# EAGLE design NRF Breakout (EAGLE 6.4)
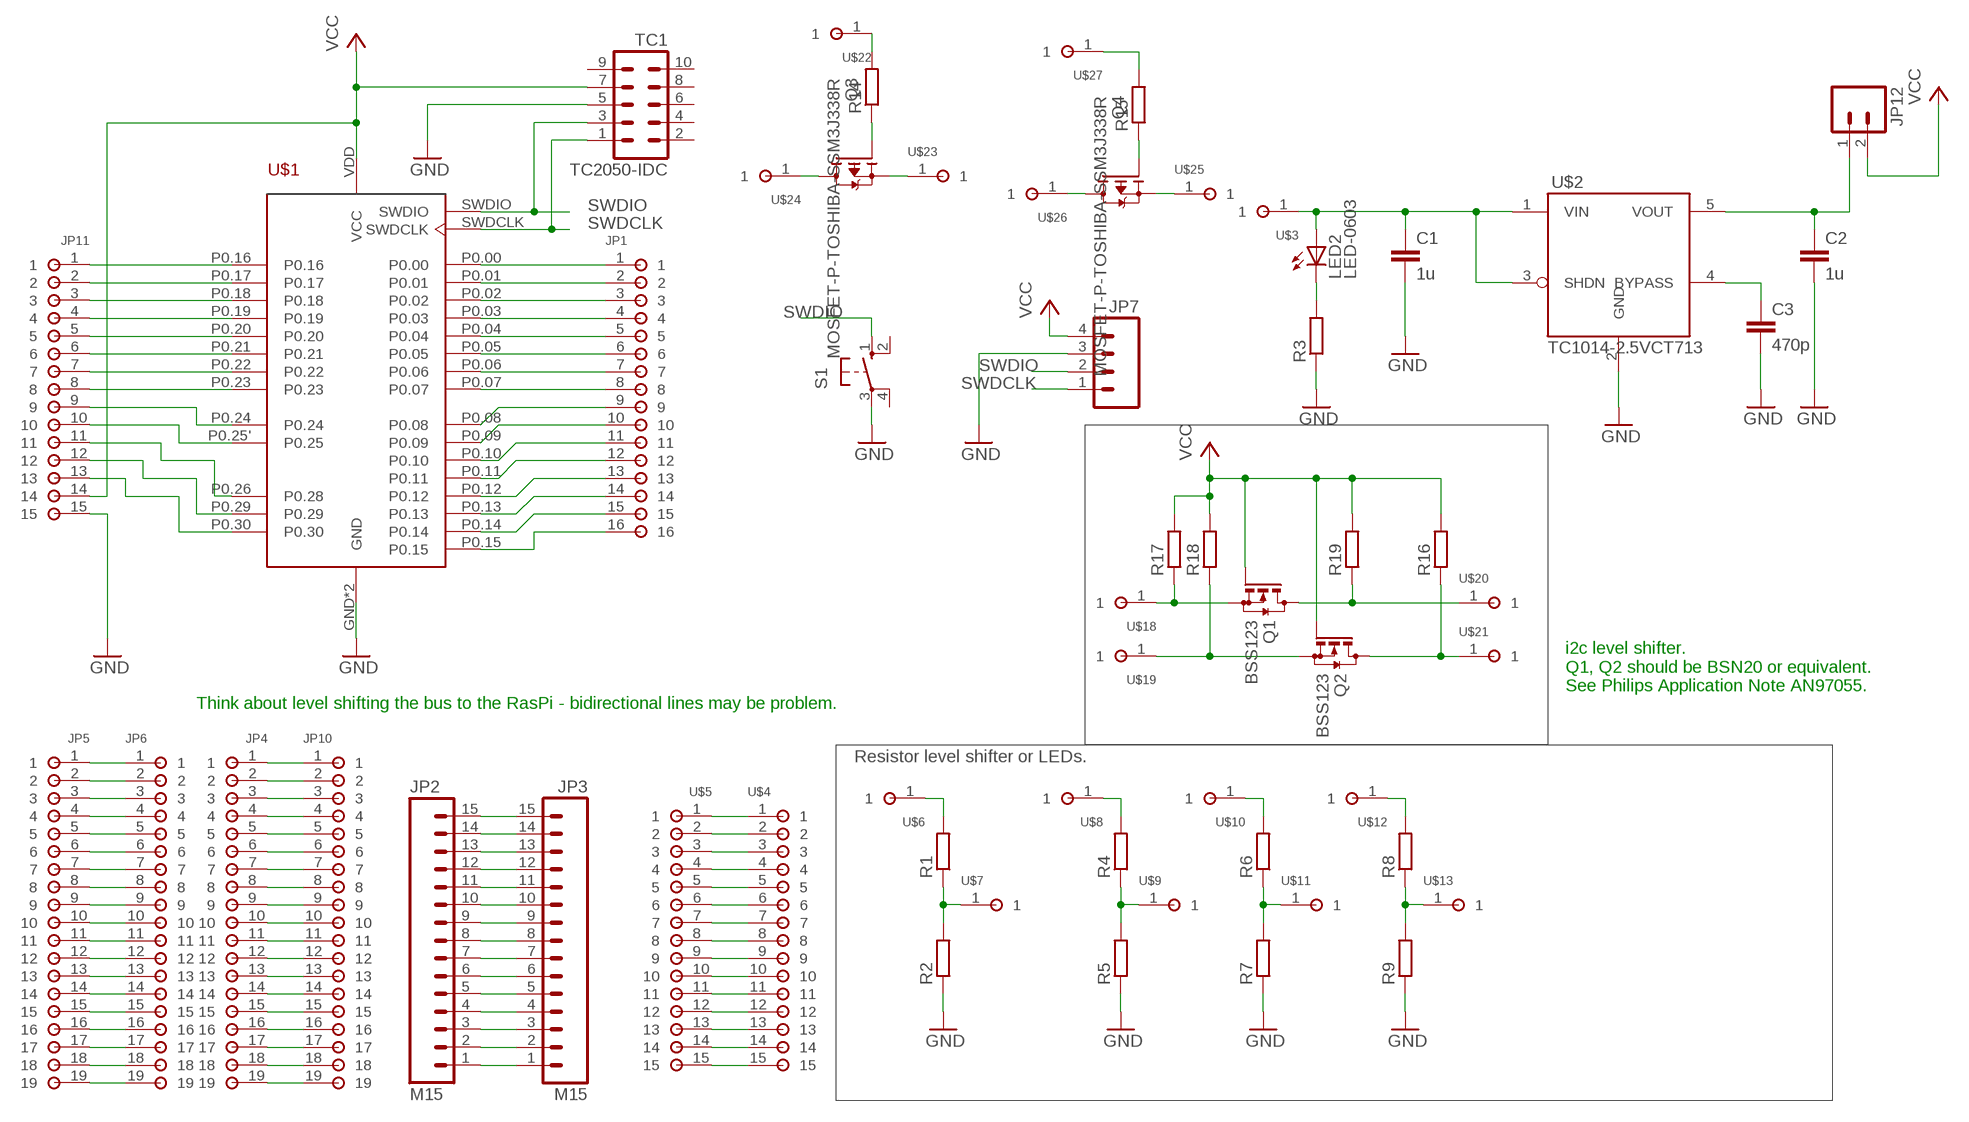
[diagram p0: schematic, sheet 1]

## Parts
C1  1u  C-EUC0603  [C0603]
C2  1u  C-EUC0603  [C0603]
C3  470p  C-EUC0603  [C0603]
JP1  PAD-16-TH  [PAD-16-TH]
JP2  M15  [1X15]
JP3  M15  [1X15]
JP4  PAD-19-2.54-TH  [PAD-19-2.54-TH]
JP5  PAD-19-2.54-TH  [PAD-19-2.54-TH]
JP6  PAD-19-2.54-TH  [PAD-19-2.54-TH]
JP7  M04PTH  [1X04]
JP10  PAD-19-2.54-TH  [PAD-19-2.54-TH]
JP11  PAD-15  [PAD-15-TH]
JP12  M02PTH  [1X02]
LED2  LED-0603  [CHIPLED_0603]
Q1  BSS123  [SOT23]
Q2  BSS123  [SOT23]
Q3  MOSFET-P-TOSHIBA-SSM3J338R  [SOT23]
Q4  MOSFET-P-TOSHIBA-SSM3J338R  [SOT23]
R1  R-EU_R0603  [R0603]
R2  R-EU_R0603  [R0603]
R3  R-EU_R0603  [R0603]
R4  R-EU_R0603  [R0603]
R5  R-EU_R0603  [R0603]
R6  R-EU_R0603  [R0603]
R7  R-EU_R0603  [R0603]
R8  R-EU_R0603  [R0603]
R9  R-EU_R0603  [R0603]
R14  R-EU_R0603  [R0603]
R15  R-EU_R0603  [R0603]
R16  R-EU_R0603  [R0603]
R17  R-EU_R0603  [R0603]
R18  R-EU_R0603  [R0603]
R19  R-EU_R0603  [R0603]
S1  TACT-4PIN  [B3F-10XX]
TC1  TC2050-IDC  [TC2050-IDC]
U$1  BREAKOUT-NRF51822CORE-SULLINS-NPPN092FFKS-RC  [BREAKOUT-NRF51822-CORE-SULLINS-NPPN092FFKS-RC]
U$2  TC1014-2.5VCT713  [SOT-23-5]
U$3  PAD-1-TH  [PAD-1-TH]
U$4  PAD-15  [PAD-15-TH]
U$5  PAD-15  [PAD-15-TH]
U$6  PAD-1-TH  [PAD-1-TH]
U$7  PAD-1-TH  [PAD-1-TH]
U$8  PAD-1-TH  [PAD-1-TH]
U$9  PAD-1-TH  [PAD-1-TH]
U$10  PAD-1-TH  [PAD-1-TH]
U$11  PAD-1-TH  [PAD-1-TH]
U$12  PAD-1-TH  [PAD-1-TH]
U$13  PAD-1-TH  [PAD-1-TH]
U$18  PAD-1-TH  [PAD-1-TH]
U$19  PAD-1-TH  [PAD-1-TH]
U$20  PAD-1-TH  [PAD-1-TH]
U$21  PAD-1-TH  [PAD-1-TH]
U$22  PAD-1-TH  [PAD-1-TH]
U$23  PAD-1-TH  [PAD-1-TH]
U$24  PAD-1-TH  [PAD-1-TH]
U$25  PAD-1-TH  [PAD-1-TH]
U$26  PAD-1-TH  [PAD-1-TH]
U$27  PAD-1-TH  [PAD-1-TH]

## Nets
GND: C1.2 C2.2 C3.2 JP7.3 JP11.15 R2.1 R3.1 R5.1 R7.1 R9.1 S1.3(P) TC1.5 U$1.GND U$1.GND2(GND) U$2.2(GND)
HIGH1: Q1.3(D) R19.1 U$20.1
HIGH2: Q2.3(D) R16.1 U$21.1
LOW1: Q1.2(S) R17.1 U$18.1
LOW2: Q2.2(S) R18.1 U$19.1
N$1: JP2.1 JP3.1
N$2: C3.1 U$2.4(BYPASS)
N$4: R1.2 U$6.1
N$5: R1.1 R2.2 U$7.1
N$7: JP5.2 JP6.2
N$8: JP5.14 JP6.14
N$9: JP5.3 JP6.3
N$10: JP5.4 JP6.4
N$11: JP5.5 JP6.5
N$12: JP5.6 JP6.6
N$13: JP5.7 JP6.7
N$14: JP5.8 JP6.8
N$15: JP5.9 JP6.9
N$16: JP5.10 JP6.10
N$17: JP5.11 JP6.11
N$18: JP5.12 JP6.12
N$19: JP5.13 JP6.13
N$20: JP5.15 JP6.15
N$21: JP5.16 JP6.16
N$22: R14.2 U$22.1
N$23: JP11.2 U$1.P0.17
N$24: JP11.3 U$1.P0.18
N$25: JP11.4 U$1.P0.19
N$26: JP11.5 U$1.P0.20
N$27: JP1.12 U$1.P0.11
N$28: JP1.11 U$1.P0.10
N$29: JP1.13 U$1.P0.12
N$30: R4.2 U$8.1
N$31: JP1.6 U$1.P0.05
N$32: JP1.14 U$1.P0.13
N$33: JP1.15 U$1.P0.14
N$34: Q3.1(G) R14.1
N$35: JP11.6 U$1.P0.21
N$36: JP11.7 U$1.P0.22
N$37: JP11.8 U$1.P0.23
N$38: JP5.17 JP6.17
N$39: JP5.18 JP6.18
N$40: JP5.19 JP6.19
N$41: JP5.1 JP6.1
N$42: JP4.19 JP10.19
N$43: JP4.18 JP10.18
N$44: JP4.17 JP10.17
N$45: JP4.16 JP10.16
N$46: JP4.15 JP10.15
N$47: JP4.14 JP10.14
N$48: JP4.13 JP10.13
N$49: JP4.12 JP10.12
N$50: JP4.11 JP10.11
N$51: JP4.10 JP10.10
N$52: JP4.9 JP10.9
N$53: JP4.8 JP10.8
N$54: JP4.7 JP10.7
N$55: JP4.6 JP10.6
N$56: JP4.5 JP10.5
N$57: JP4.4 JP10.4
N$58: JP4.3 JP10.3
N$59: JP4.2 JP10.2
N$60: JP4.1 JP10.1
N$61: JP2.2 JP3.2
N$62: JP2.3 JP3.3
N$63: JP2.4 JP3.4
N$64: JP2.5 JP3.5
N$65: JP2.6 JP3.6
N$66: JP2.7 JP3.7
N$67: JP2.8 JP3.8
N$68: JP2.9 JP3.9
N$69: JP2.10 JP3.10
N$70: JP2.11 JP3.11
N$71: JP2.12 JP3.12
N$72: JP2.13 JP3.13
N$73: JP2.14 JP3.14
N$74: JP2.15 JP3.15
N$75: U$4.1 U$5.1
N$76: U$4.2 U$5.2
N$77: U$4.3 U$5.3
N$78: U$4.4 U$5.4
N$79: U$4.5 U$5.5
N$80: U$4.6 U$5.6
N$81: U$4.7 U$5.7
N$82: U$4.8 U$5.8
N$83: U$4.9 U$5.9
N$84: U$4.10 U$5.10
N$85: U$4.11 U$5.11
N$86: U$4.12 U$5.12
N$87: U$4.13 U$5.13
N$88: U$4.14 U$5.14
N$89: U$4.15 U$5.15
N$90: R4.1 R5.2 U$9.1
N$91: LED2.C R3.2
N$92: R6.2 U$10.1
N$93: R6.1 R7.2 U$11.1
N$94: R8.2 U$12.1
N$95: R8.1 R9.2 U$13.1
N$100: Q3.3(D) U$24.1
N$101: Q3.2(S) U$23.1
N$102: R15.2 U$27.1
N$103: Q4.1(G) R15.1
N$104: Q4.2(S) U$25.1
N$105: Q4.3(D) U$26.1
P0.00: JP1.1 U$1.P0.00
P0.01: JP1.2 U$1.P0.01
P0.02: JP1.3 U$1.P0.02
P0.03: JP1.4 U$1.P0.03
P0.04: JP1.5 U$1.P0.04
P0.06: JP1.7 U$1.P0.06
P0.07: JP1.8 U$1.P0.07
P0.08: JP1.9 U$1.P0.08
P0.09: JP1.10 U$1.P0.09
P0.15: JP1.16 U$1.P0.15
P0.16: JP11.1 U$1.P0.16
P0.24: JP11.9 U$1.P0.24
P0.25: JP11.10 U$1.P0.25'(P0.25)
P0.28: JP11.11 U$1.P0.26(P0.28)
P0.29: JP11.12 U$1.P0.29
P0.30: JP11.13 U$1.P0.30
SWDCLK: JP7.1 TC1.1 U$1.SWDCLK
SWDIO: JP7.2 S1.1(S) TC1.3 U$1.SWDIO
VCC: JP7.4 JP11.14 JP12.2 Q1.1(G) Q2.1(G) R16.2 R17.2 R18.2 R19.2 TC1.7 U$1.VDD(VCC)
VIN: C1.1 LED2.A U$2.1(VIN) U$2.3(SHDN) U$3.1
VOUT: C2.1 JP12.1 U$2.5(VOUT)
Unconnected: S1.2(S1) S1.4(P1) TC1.2 TC1.4 TC1.6 TC1.8 TC1.9 TC1.10

## Notes on the sheet
- i2c level shifter. 
  Q1, Q2 should be BSN20 or equivalent. 
  See Philips Application Note AN97055.
- Think about level shifting the bus to the RasPi - bidirectional lines may be problem.
- Resistor level shifter or LEDs.

## Library data of the parts
C1-C3 = Erland's Library:C-EU: CAPACITOR, European symbol
JP1 = Erland's Library:PAD-16
JP2 JP3 = SparkFun-Connectors:M15: Header 15 Standard 15-pin 0.1" header. Use with straight break away headers (SKU : PRT-00116), right angle break away headers (PRT-00553), swiss pins (PRT-00743), machine pins (PRT-00117), and female headers (PRT-00115).
JP4-JP6 JP10 = Erland's Library:PAD-19
JP7 = SparkFun-Connectors:M04: Header 4 Standard 4-pin 0.1" header. Use with straight break away headers (SKU : PRT-00116), right angle break away headers (PRT-00553), swiss pins (PRT-00743), machine pins (PRT-00117), and female headers (PRT-00115). Molex polarized connector foot print use with SKU : PRT-08231 with associated crimp pins and housings. 1MM SMD Version SKU: PRT-10208
JP11 U$4 U$5 = Erland's Library:PAD-15
JP12 = SparkFun-Connectors:M02: Header 2 Standard 2-pin 0.1" header. Use with straight break away headers (SKU : PRT-00116), right angle break away headers (PRT-00553), swiss pins (PRT-00743), machine pins (PRT-00117), and female headers (PRT-00115). Molex polarized connector foot print use with SKU : PRT-08233 with associated crimp pins and housings.
LED2 = Erland's Library:LED
Q1 Q2 = Erland's Library:BSS123: N-CHANNEL MOS FET
Q3 Q4 = Erland's Library:MOSFET-P
R1-R9 R14-R19 = Erland's Library:R-EU_: RESISTOR, European symbol
S1 = Erland's Library:TACT-4PIN: OMRON SWITCH; MPN: B3F-1000; OC_FARNELL: 176432; OC_NEWARK: 36M3542
TC1 = TagConnect:TC2050-IDC: Tag-Connect In Circuit Programming & Debug Cable 10 Pin http://www.tag-connect.com
U$1 = Erland's Library:BREAKOUT-NRF51822CORE
U$2 = Erland's Library:TC1014
U$3 U$6-U$13 U$18-U$27 = Erland's Library:PAD-1

## Board
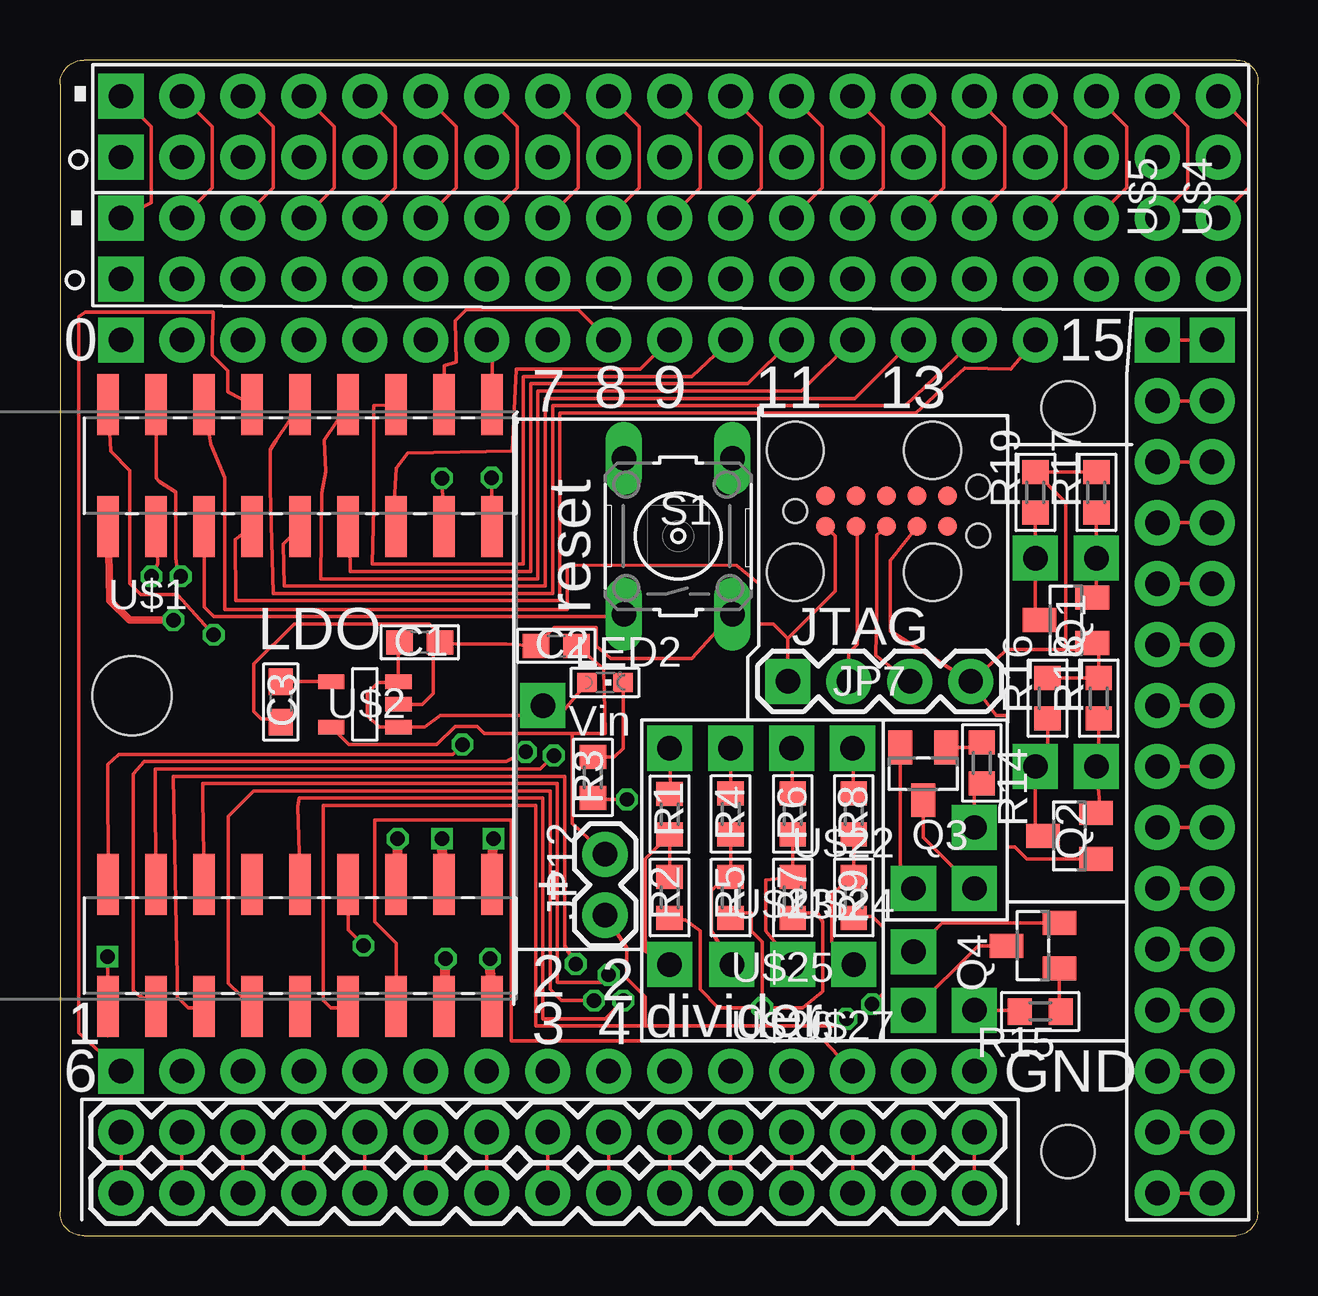
[diagram p1: board, top side]
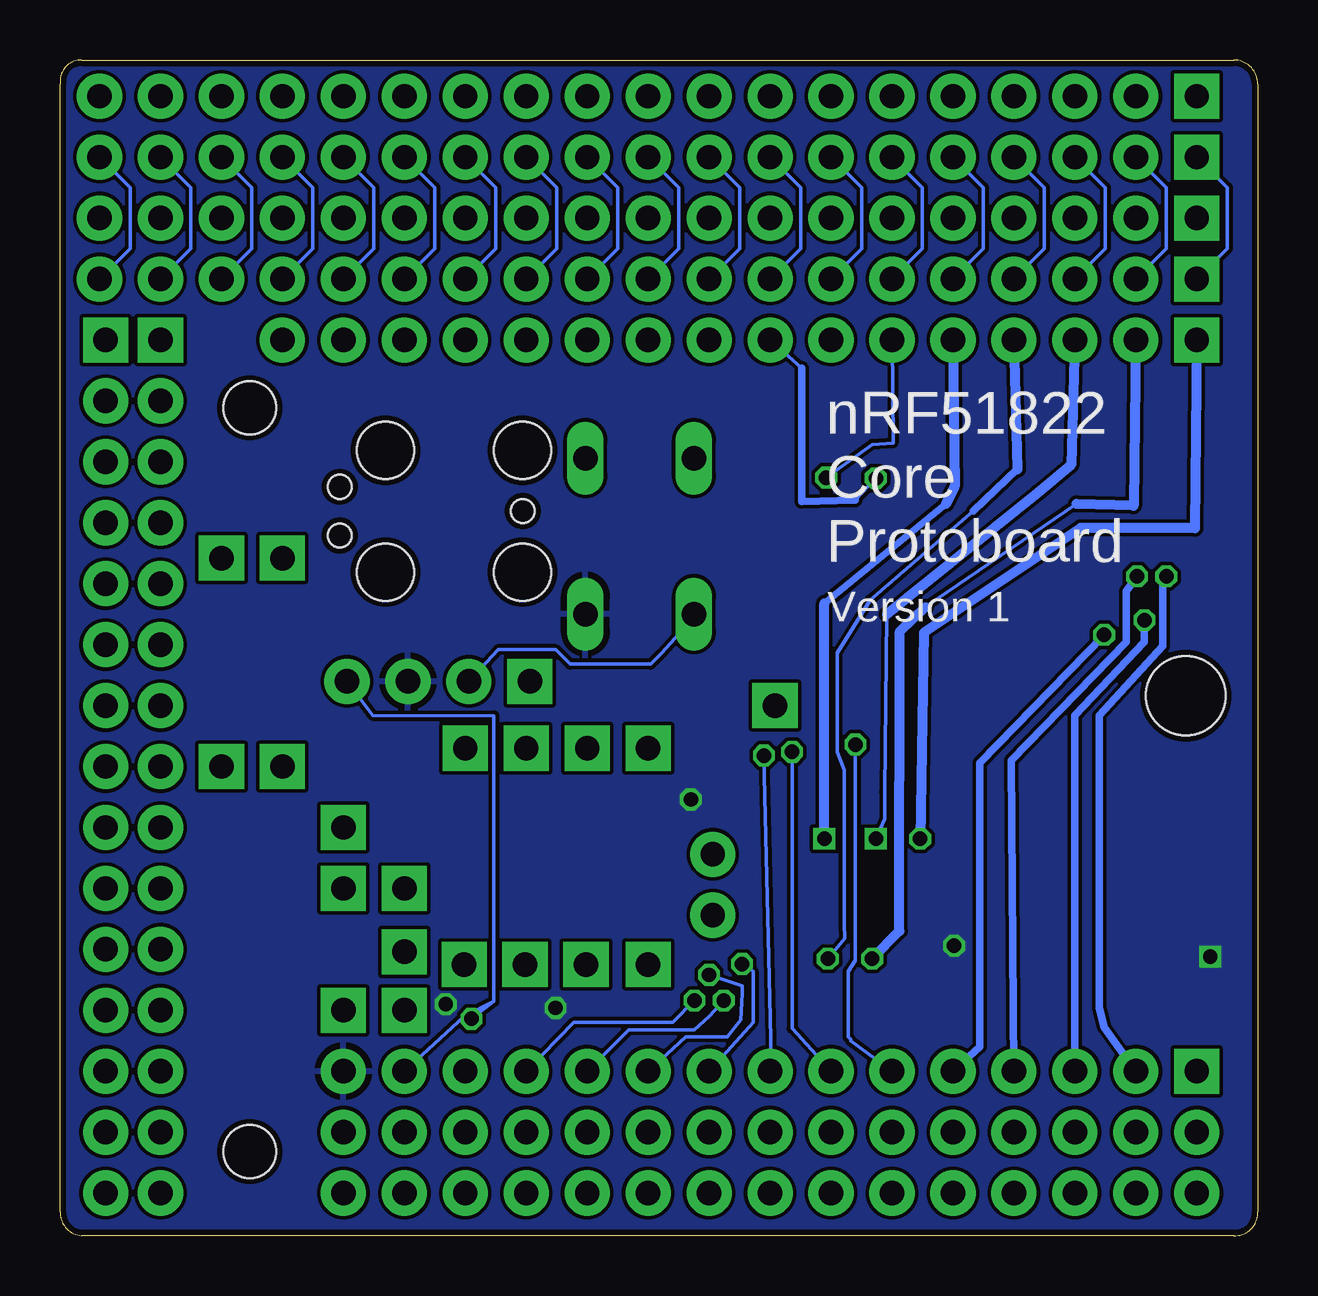
[diagram p2: board, bottom side, seen from below]

Size 49.91 x 49 mm. Coordinates in mm from the lower left corner, seen from the top.
Outline: 1,0 49,0 arc90 49.9,1 49.9,48 arc99 49,49 1,49 arc90 0,48 0,1 arc98 1,0
Copper layers (1*16): Top 0.035mm / dielectric 1.5mm / Bottom 0.035mm
Design rules "SeeedStudio_2layer_DRU_no_angle_20140221": minimum track width 6mil, minimum drill 12mil, track to track 6mil, track to pad 6mil, pad to pad 6mil, via to via 6mil, smd to smd 0mil, copper to edge 10mil, drill to drill 10mil, minimum pad ring 10mil, minimum via ring 6mil, stop-mask expansion 2mil, vias tented up to drill 100mil, thermal gap 10mil
Holes 3.3 mm at 3,22.5
Holes 2.2 mm at 42,34.5 42,3.5

### Footprints (pad centres in the part's own frame; a part is rotated, then mirrored left to right if it is on the bottom)
C0603 = smd 1.1 x 1: 1 -0.85,0; 2 0.85,0
PAD-16-TH = drill 1.016 pad 1.88 square: 1 0,0 | drill 1.016 pad 1.88: 2 2.54,0; 3 5.08,0; 4 7.62,0; 5 10.16,0; 6 12.7,0; 7 15.24,0; 8 17.78,0; 9 20.32,0; 10 22.86,0; 11 25.4,0; 12 27.94,0; 13 30.48,0; 14 33.02,0; 15 35.56,0; 16 38.1,0
1X15 = drill 1.016 pad 1.88: 1 0,0; 2 2.54,0; 3 5.08,0; 4 7.62,0; 5 10.16,0; 6 12.7,0; 7 15.24,0; 8 17.78,0; 9 20.32,0; 10 22.86,0; 11 25.4,0; 12 27.94,0; 13 30.48,0; 14 33.02,0; 15 35.56,0
PAD-19-2.54-TH = drill 1.016 pad 1.88 square: 1 0,0 | drill 1.016 pad 1.88: 2 2.54,0; 3 5.08,0; 4 7.62,0; 5 10.16,0; 6 12.7,0; 7 15.24,0; 8 17.78,0; 9 20.32,0; 10 22.86,0; 11 25.4,0; 12 27.94,0; 13 30.48,0; 14 33.02,0; 15 35.56,0; 16 38.1,0; 17 40.64,0; 18 43.18,0; 19 45.72,0
1X04 = drill 1.016 pad 1.88 square: 1 0,0 | drill 1.016 pad 1.88: 2 2.54,0; 3 5.08,0; 4 7.62,0
PAD-15-TH = drill 1.016 pad 1.88 square: 1 0,0 | drill 1.016 pad 1.88: 2 2.54,0; 3 5.08,0; 4 7.62,0; 5 10.16,0; 6 12.7,0; 7 15.24,0; 8 17.78,0; 9 20.32,0; 10 22.86,0; 11 25.4,0; 12 27.94,0; 13 30.48,0; 14 33.02,0; 15 35.56,0
1X02 = drill 1.016 pad 1.88: 1 0,0; 2 2.54,0
CHIPLED_0603 = smd 0.8 x 0.8: A 0,-0.75; C 0,0.75
SOT23 = smd 1 x 1.4: 1 -0.95,-1.1; 2 0.95,-1.1; 3 0,1.1
R0603 = smd 1 x 1.1: 1 -0.85,0; 2 0.85,0
B3F-10XX = drill 1.016 long: 1 -3.251,2.261; 2 3.251,2.261; 3 -3.251,-2.261; 4 3.251,-2.261
TC2050-IDC = smd 0.787 x 0.787: 1 -2.54,-0.635; 2 -2.54,0.635; 3 -1.27,-0.635; 4 -1.27,0.635; 5 0,-0.635; 6 0,0.635; 7 1.27,-0.635; 8 1.27,0.635; 9 2.54,-0.635; 10 2.54,0.635 | hole 0.991: -3.81,0; 3.81,1.016; 3.81,-1.016 | hole 2.375: -3.81,2.54; -3.81,-2.54; 1.905,2.54; 1.905,-2.54
BREAKOUT-NRF51822-CORE-SULLINS-NPPN092FFKS-RC = smd 0.89 x 2.54: GND 2,-7.46; GND2 -8,-12.54; P0.00 4,-7.46; P0.01 6,-12.54; P0.02 6,-7.46; P0.03 8,-12.54; P0.04 8,-7.46; P0.05 8,7.46; P0.06 8,12.54; P0.07 6,7.46; P0.08 6,12.54; P0.09 4,7.46; P0.10 4,12.54; P0.11 2,7.46; P0.12 2,12.54; P0.13 0,7.46; P0.14 0,12.54; P0.15 -2,7.46; P0.16 -2,12.54; P0.17 -6,7.46; P0.18 -8,7.46; P0.19 -6,12.54; P0.20 -8,12.54; P0.21 -8,-7.46; P0.22 -6,-12.54; P0.23 -6,-7.46; P0.24 -4,-12.54; P0.25' -4,-7.46; P0.26 -2,-12.54; P0.27 -2,-7.46; P0.28 0,-12.54; P0.29 0,-7.46; P0.30 4,-12.54; SWDCLK -4,12.54; SWDIO -4,7.46; VDD 2,-12.54
SOT-23-5 = smd 0.6 x 1.1: 1 -0.95,-1.4; 2 0,-1.4; 3 0.95,-1.4; 4 0.95,1.4; 5 -0.95,1.4
PAD-1-TH = drill 1.016 pad 1.88 square: 1 0,0

### Placement (x,y rotation side)
C1  14.99,24.73 0 top
C2  20.68,24.58 180 top
C3  9.2,22.24 270 top
JP1  2.54,37.33 0 top
JP2  2.54,4.31 0 top
JP3  2.54,1.77 0 top
JP4  2.54,44.95 0 top
JP5  2.54,42.41 0 top
JP6  2.54,47.49 0 top
JP7  30.33,23.1 0 top
JP10  2.54,39.87 0 top
JP11  2.54,6.85 0 top
JP12  22.71,15.89 270 top
LED2  22.71,23.06 270 top
Q1  41.91,25.65 90 top
Q2  42.06,16.66 90 top
Q3  35.97,19.25 180 top
Q4  40.54,12.08 90 top
R1  25.4,17.56 90 top
R2  25.4,14.09 90 top
R3  22.2,19.09 90 top
R4  27.94,17.57 90 top
R5  27.94,14.09 90 top
R6  30.53,17.57 90 top
R7  30.53,14.09 90 top
R8  33.07,17.57 90 top
R9  33.07,14.09 90 top
R14  38.41,19.7 270 top
R15  40.84,9.34 180 top
R16  41.15,22.4 90 top
R17  43.18,30.98 90 top
R18  43.28,22.4 90 top
R19  40.64,30.98 90 top
S1  25.76,29.15 90 top
TC1  34.44,30.19 0 top
U$1  10,22.09 0 top
U$2  12.7,22.14 90 top
U$3  20.12,22.09 0 top
U$4  48.01,37.33 270 top
U$5  45.72,37.33 270 top
U$6  25.4,20.31 0 top
U$7  25.4,11.3 0 top
U$8  27.94,20.31 0 top
U$9  27.99,11.3 0 top
U$10  30.48,20.31 0 top
U$11  30.53,11.3 0 top
U$12  33.02,20.31 0 top
U$13  33.07,11.3 0 top
U$18  43.18,28.24 90 top
U$19  43.18,19.55 90 top
U$20  40.64,28.24 90 top
U$21  40.64,19.55 90 top
U$22  38.1,17.01 0 top
U$23  35.56,14.47 0 top
U$24  38.1,14.47 0 top
U$25  35.56,11.83 0 top
U$26  35.56,9.39 0 top
U$27  38.1,9.39 0 top

### Tracks (layer width: path | path; a pad name or v marks a point on that pad's centre or on a via)
GND  (via drill 0.6)
  Top 0.152: U$1.GND2 1.98,8.32 v1.98,11.63 | U$2.2 15.09,22.14 15.55,22.6 15.55,24.44 C1.2 | C3.2 9.05,21.53 8.38,21.53 8.08,21.84 8.08,23.82 9.76,25.5 15.39,25.5 15.84,25.05 C1.2 | C1.2 16.51,24.67 18.59,24.67 C2.2 20.59,25.34 22.35,25.34 22.35,24.58 22.94,24.05 26.32,24.05 S1.3 | R2.1 25.66,13.15 26.06,13.15 26.67,12.69 26.67,10.26 27.43,9.49 v29.26,9.49 | R5.1 28.11,13.46 28.81,13.46 28.81,12.69 29.26,12.24 v29.26,9.49 | v29.26,9.49 30.94,9.49 31.78,10.18 | R7.1 30.85,13.46 31.55,13.46 31.78,13.07 31.78,10.18 | TC1.5 34.04,29.2 34.04,25.95 33.99,24.17 JP7.3 | R9.1 33.29,13.3 33.83,13.3 34.29,12.85 34.29,10.1 v33.83,9.65 | U$1.GND 12,12.73 v12.65,12.08 | 31.7,10.1 31.78,10.18 | v23.62,18.18 22.27,18.18 R3.1
  Bottom 0.152: S1.3 28.14,25.75
  pour Bottom: 0.31,48.81 50.08,49.11 49.94,-0.05 -0.1,0.01
HIGH1
  Top 0.152: R19.1 U$20.1 40.64,25.82 Q1.3
HIGH2
  Top 0.152: R16.1 41.15,19.65 U$21.1 40.64,16.98 Q2.3
LOW1
  Top 0.152: 43.13,28.34 U$18.1 | R17.1 U$18.1 | U$18.1 43.18,26.77 Q1.2
LOW2
  Top 0.152: R18.1 43.28,19.6 U$19.1 43.33,17.78 Q2.2
N$1
  Top 0.152: JP3.1 JP2.1
N$2
  Top 0.152: U$2.4 C3.1
N$4
  Top 0.152: R1.2 25.45,18.46 U$6.1
N$5
  Top 0.152: R2.2 R1.1 24.39,15.7 24.39,11.84 U$7.1
N$7
  Top 0.152: JP6.2 6.35,46.22 6.35,43.68 JP5.2
N$8
  Top 0.152: JP6.14 36.83,46.22 36.83,43.68 JP5.14
N$9
  Top 0.152: JP6.3 8.89,46.22 8.89,43.68 JP5.3
N$10
  Top 0.152: JP6.4 11.43,46.22 11.43,43.68 JP5.4
N$11
  Top 0.152: JP6.5 13.97,46.22 13.97,43.68 JP5.5
N$12
  Top 0.152: JP6.6 16.51,46.22 16.51,43.68 JP5.6
N$13
  Top 0.152: JP6.7 19.05,46.22 19.05,43.68 JP5.7
N$14
  Top 0.152: JP6.8 21.59,46.22 21.59,43.68 JP5.8
N$15
  Top 0.152: JP6.9 24.13,46.22 24.13,43.68 JP5.9
N$16
  Top 0.152: JP6.10 26.67,46.22 26.67,43.68 JP5.10
N$17
  Top 0.152: JP6.11 29.21,46.22 29.21,43.68 JP5.11
N$18
  Top 0.152: JP6.12 31.75,46.22 31.75,43.68 JP5.12
N$19
  Top 0.152: JP6.13 34.29,46.22 34.29,43.68 JP5.13
N$20
  Top 0.152: JP6.15 39.37,46.22 39.37,43.68 JP5.15
N$21
  Top 0.152: JP6.16 41.91,46.22 41.91,43.68 JP5.16
N$22
  Top 0.152: U$22.1 38.1,18.4 R14.2
N$23  (via drill 0.6)
  Top 0.152: U$1.P0.17 4.07,27.98 v3.81,27.48
  Bottom 0.305: JP11.2 6.4,8.68 6.61,9.49 6.61,21.69 3.96,24.58 3.96,27.32 v3.81,27.48
N$24  (via drill 0.6)
  Top 0.305: v4.73,25.65 2.9,25.65 2.07,26.48 U$1.P0.18
  Bottom 0.305: JP11.3 7.62,21.69 4.73,24.73 v4.73,25.65
N$25  (via drill 0.6)
  Top 0.152: v5.03,27.48 4.88,27.78 4.83,28.24 4.83,30.98 4.14,31.44 4,31.58 U$1.P0.19
  Bottom 0.305: v5.03,27.48 5.49,26.87 5.49,24.73 10.26,19.81 JP11.4
N$26  (via drill 0.6)
  Top 0.152: v6.4,25.04 4.88,26.71 3.35,26.71 2.9,27.17 2.9,31.9 2.12,32.7 U$1.P0.20
  Bottom 0.305: v6.4,25.04 11.58,19.7 11.58,7.87 JP11.5
N$27
  Top 0.152: U$1.P0.11 12.07,28.83 12.09,27.68 19.61,27.68 19.61,35.5 28.65,35.5 JP1.12
N$28
  Top 0.152: U$1.P0.10 13.07,34.6 13.07,30.35 13,27.98 19.31,27.98 19.31,35.81 26.32,35.81 JP1.11
N$29
  Top 0.152: U$1.P0.12 11,33.15 11.07,31.84 10.92,30.96 10.87,27.37 19.92,27.37 19.92,35.2 30.89,35.2 JP1.13
N$30
  Top 0.152: R4.2 U$8.1
N$31  (via drill 0.6)
  Top 0.152: v17.98,31.59 17.98,30.74 U$1.P0.05
  Bottom 0.152: JP1.6 15.19,33.04 16.07,32.97 v17.98,31.59
N$32
  Top 0.152: U$1.P0.13 9.31,28.83 9.34,27.07 20.22,27.07 20.22,34.89 33.12,34.89 JP1.14
N$33
  Top 0.152: U$1.P0.14 9,33.15 8.76,32.76 8.76,31.11 8.89,26.77 20.52,26.77 20.52,34.59 35.21,34.59 JP1.15
N$34
  Top 0.152: Q3.1 38.35,20.35 R14.1
N$35  (via drill 0.6)
  Top 0.152: U$1.P0.21 1.98,19.63 2.44,20.06 16.36,20.06 v16.77,20.47
  Bottom 0.152: JP11.6 16.97,8.12 16.97,8.17 17.07,8.27 17.07,11.02 16.77,11.47 v16.77,20.47
N$36  (via drill 0.6)
  Top 0.152: U$1.P0.22 3.05,10.17 3.05,19.25 3.51,19.75 18.59,19.75 v19.41,20.16
  Bottom 0.152: v19.41,20.16 19.41,8.63 JP11.7
N$37  (via drill 0.6)
  Top 0.152: U$1.P0.23 3.96,17.54 3.96,19.45 20.02,19.45 v20.58,20.01
  Bottom 0.152: v20.58,20.01 20.27,7.36 JP11.8
N$38
  Top 0.152: JP6.17 44.45,46.22 44.45,43.68 JP5.17
N$39
  Top 0.152: JP6.18 46.99,46.22 46.99,43.68 JP5.18
N$40
  Top 0.152: JP6.19 49.53,46.22 49.53,43.68 JP5.19
N$41
  Top 0.152: JP6.1 3.81,46.22 3.81,43.05 JP5.1
N$42
  Bottom 0.152: JP4.19 46.99,43.68 46.99,41.14 JP10.19
N$43
  Bottom 0.152: JP4.18 44.45,43.68 44.45,41.14 JP10.18
N$44
  Bottom 0.152: JP4.17 41.91,43.68 41.91,41.14 JP10.17
N$45
  Bottom 0.152: JP4.16 39.37,43.68 39.37,41.14 JP10.16
N$46
  Bottom 0.152: JP4.15 36.83,43.68 36.83,41.14 JP10.15
N$47
  Bottom 0.152: JP4.14 34.29,43.68 34.29,41.14 JP10.14
N$48
  Bottom 0.152: JP4.13 31.75,43.68 31.75,41.14 JP10.13
N$49
  Bottom 0.152: JP4.12 29.21,43.68 29.21,41.14 JP10.12
N$50
  Bottom 0.152: JP4.11 26.67,43.68 26.67,41.14 JP10.11
N$51
  Bottom 0.152: JP4.10 24.13,43.68 24.13,41.14 JP10.10
N$52
  Bottom 0.152: JP4.9 21.59,43.68 21.59,41.14 JP10.9
N$53
  Bottom 0.152: JP4.8 19.05,43.68 19.05,41.14 JP10.8
N$54
  Bottom 0.152: JP4.7 16.51,43.68 16.51,41.14 JP10.7
N$55
  Bottom 0.152: JP4.6 13.97,43.68 13.97,41.14 JP10.6
N$56
  Bottom 0.152: JP4.5 11.43,43.68 11.43,41.14 JP10.5
N$57
  Bottom 0.152: JP4.4 8.89,43.68 8.89,41.14 JP10.4
N$58
  Bottom 0.152: JP4.3 6.35,43.68 6.35,41.14 JP10.3
N$59
  Bottom 0.152: JP4.2 3.81,43.68 3.81,41.14 JP10.2
N$60
  Bottom 0.152: JP4.1 1.27,43.68 1.27,41.14 JP10.1
N$61
  Top 0.152: JP3.2 JP2.2
N$62
  Top 0.152: JP3.3 JP2.3
N$63
  Top 0.152: JP3.4 JP2.4
N$64
  Top 0.152: JP3.5 JP2.5
N$65
  Top 0.152: JP3.6 JP2.6
N$66
  Top 0.152: JP3.7 JP2.7
N$67
  Top 0.152: JP3.8 JP2.8
N$68
  Top 0.152: JP3.9 JP2.9
N$69
  Top 0.152: JP3.10 JP2.10
N$70
  Top 0.152: JP3.11 JP2.11
N$71
  Top 0.152: JP3.12 JP2.12
N$72
  Top 0.152: JP3.13 JP2.13
N$73
  Top 0.152: JP3.14 JP2.14
N$74
  Top 0.152: JP3.15 JP2.15
N$75
  Top 0.152: U$5.1 U$4.1
N$76
  Top 0.152: U$5.2 U$4.2
N$77
  Top 0.152: U$5.3 U$4.3
N$78
  Top 0.152: U$5.4 U$4.4
N$79
  Top 0.152: U$5.5 U$4.5
N$80
  Top 0.152: U$5.6 U$4.6
N$81
  Top 0.152: U$5.7 U$4.7
N$82
  Top 0.152: U$5.8 U$4.8
N$83
  Top 0.152: U$5.9 U$4.9
N$84
  Top 0.152: U$5.10 U$4.10
N$85
  Top 0.152: U$5.11 U$4.11
N$86
  Top 0.152: U$5.12 U$4.12
N$87
  Top 0.152: U$5.13 U$4.13
N$88
  Top 0.152: U$5.14 U$4.14
N$89
  Top 0.152: U$5.15 U$4.15
N$90
  Top 0.152: U$9.1 27.13,12.69 27.13,14.37 27.98,15.22 R5.2 R4.1
N$91
  Top 0.152: R3.2 23.1,19.94 23.47,20.31 23.47,21.67 LED2.C
N$92
  Top 0.152: R6.2 U$10.1
N$93
  Top 0.152: U$11.1 29.41,12.69 29.41,14.83 30.26,14.92 R7.2 R6.1
N$94
  Top 0.152: R8.2 U$12.1
N$95
  Top 0.152: R8.1 R9.2 33.16,15.07 32.16,14.22 32.16,12.24 U$13.1
N$100
  Top 0.152: Q3.3 35.97,16.61 U$24.1
N$101
  Top 0.152: Q3.2 35.02,15.02 U$23.1
N$102
  Top 0.152: U$27.1 39.94,9.39 R15.2
N$103
  Top 0.152: Q4.1 41.64,9.4 R15.1
N$104
  Top 0.152: Q4.2 36.77,13.03 U$25.1
N$105
  Top 0.152: Q4.3 38.25,12.08 U$26.1
P0.00  (via drill 0.6)
  Top 0.406: v14.07,16.54 U$1.P0.00
  Bottom 0.406: JP1.1 2.62,29.48 7.38,29.5 13.92,25.13 v14.07,16.54
P0.01  (via drill 0.6)
  Top 0.406: U$1.P0.01 v16.07,11.54
  Bottom 0.152: 7.56,30.5 13.85,26.2
  Bottom 0.406: v16.07,11.54 16.07,11.56 14.94,12.69 14.92,25.19 13.85,26.2 | JP1.2 5.17,30.42 7.56,30.5
P0.02  (via drill 0.6)
  Top 0.406: U$1.P0.02 v15.92,16.54
  Bottom 0.152: 15.46,25.89 15.55,18.48 15.55,17.37 v15.92,16.54
  Bottom 0.406: JP1.3 7.77,32.12 9.17,30.96 15.46,25.89
P0.03  (via drill 0.6)
  Top 0.406: U$1.P0.03 v17.92,11.54
  Bottom 0.152: v17.92,11.54 17.22,12.39 17.22,13 17.22,19.4 17.53,20.16 17.53,24.28 16.15,26.5 11.85,30.2
  Bottom 0.305: 10.02,31.95 11.85,30.2
  Bottom 0.406: JP1.4 10.02,31.95
P0.04  (via drill 0.6)
  Top 0.406: U$1.P0.04 v18.06,16.54
  Bottom 0.305: 13,30.5 18.06,26.35
  Bottom 0.406: v18.06,16.54 18.06,26.35 | JP1.5 12.63,31.22 13,30.5
P0.06
  Top 0.152: JP1.7 18,37.11 U$1.P0.06
P0.07  (via drill 0.6)
  Top 0.152: U$1.P0.07 v15.92,31.57
  Bottom 0.152: v15.92,31.57 16.78,30.65 | 19,36.15 JP1.8
  Bottom 0.305: 16.78,30.65 19,30.59 19,36.15
P0.08
  Top 0.152: U$1.P0.08 16,36.26 16.51,36.42 16.46,38.14 16.92,38.6 21.59,38.6 JP1.9
P0.09
  Top 0.152: 13.92,30.23 14,32 14.5,32.61 18.85,32.69 19,36.11 24.17,36.11 JP1.10
  Top 0.406: U$1.P0.09 13.92,30.23
P0.15
  Top 0.152: U$1.P0.15 7.31,29.01 7.32,26.46 20.83,26.46 20.83,34.06 20.83,34.28 35.66,34.28 37.69,36.16 39.62,36.11 JP1.16
P0.16
  Top 0.152: U$1.P0.16 7,35.16 6.99,35.18 6.99,36.06 6.35,36.7 6.35,37.2 6.38,38.5 1.04,38.5 0.79,38.3 0.79,8.45 JP11.1
P0.24  (via drill 0.6)
  Top 0.152: v21.49,11.32 21.03,12.08 21.03,19.15 4.73,19.15 4.88,10.71 4.88,9.95 5.34,9.49 5.94,9.49 U$1.P0.24
  Bottom 0.152: v21.49,11.32 21.03,11.02 21.03,8.88 JP11.9
P0.25  (via drill 0.6)
  Top 0.152: U$1.P0.25' 5.95,18.22 5.95,18.84 20.73,18.84 20.73,10.56 22.56,10.56 v22.86,10.86
  Bottom 0.152: v22.86,10.86 21.49,10.41 21.49,10.1 21.54,8.99 22.1,8.27 23.83,8.27 JP11.10
P0.28  (via drill 0.6)
  Top 0.152: U$1.P0.26 7.01,10.51 7.01,17.47 8.08,18.54 20.42,18.54 20.42,10.26 20.88,9.8 v22.25,9.8
  Bottom 0.152: v22.25,9.8 22.86,9.14 23.47,8.58 26.21,8.58 JP11.11
P0.29  (via drill 0.6)
  Top 0.152: v23.47,9.8 22.71,9.04 20.12,9.04 20.12,18.23 9.96,18.23 9.92,17.88 U$1.P0.29
  Bottom 0.152: v23.47,9.8 24.39,8.88 28.5,8.88 JP11.12
P0.30
  Top 0.152: JP11.13 31.85,8.12 18.8,8.12 18.8,17.32 13.11,17.32 13.11,13.07 14,12.17 U$1.P0.30
SWDCLK
  Top 0.152: U$1.SWDCLK 6.27,32.99 6.86,31.59 6.86,26.1 21.13,26.1 21.13,27.96 28.2,27.93 29.11,27.17 29.11,25.5 29.72,25.5 30.33,24.89 | 30.33,24.89 JP7.1 | TC1.1 32.31,29.15 32.31,26.87 30.33,24.89
SWDIO
  Top 0.152: U$1.SWDIO 6,26.2 6.4,25.8 23.39,25.8 S1.1 | JP7.2 32.87,24.28 33.22,24.63 33.22,29.46 TC1.3
  Bottom 0.152: S1.1 23.37,25.9 24.84,24.28 25.3,23.82 28.65,23.82 29.26,24.43 31.65,24.43 JP7.2
VCC  (via drill 0.6)
  Top 0.152: 24.39,8.73 19.81,8.73 19.81,17.93 10.97,17.93 10.97,9.8 11.28,9.49 11.94,9.49 U$1.VDD | 24.39,8.73 32.31,8.73 v32.77,9.04 | JP12.2 23.62,11.98 23.62,10.71 24.39,9.95 24.39,8.73 | JP7.4 34.6,25.19 34.6,28.14 TC1.7 | 41.91,24.43 42.74,24.43 Q1.1 43.28,24.43 R18.2 R16.2 | 41.91,24.43 39.47,24.43 JP7.4 | JP7.4 39.02,21.69 39.47,21.69 39.47,16.2 39.78,16.2 40.27,15.71 Q2.1 | R17.2 R19.2 41.91,30.56 41.91,24.43
  Bottom 0.152: v32.77,9.04 31.83,9.75 | 31.83,9.75 33.07,9.14 JP11.14 | JP7.4 36.88,21.69 31.83,21.67 31.83,9.75
VIN
  Top 0.152: C1.1 14.1,24.69 U$2.3 14.07,23.06 13.26,23.06 12.8,22.6 12.8,21.69 13.3,21.19 U$2.1 15.2,21.19 15.85,21.69 19.56,21.69 U$3.1 20.79,21.63 LED2.A
VOUT
  Top 0.152: U$2.5 12.03,20.47 15.7,20.47 16.46,21.23 17.38,21.23 17.68,20.92 21.34,20.92 | 21.34,20.92 21.34,17.17 JP12.1 | C2.1 22.66,23.62 22.71,20.92 21.34,20.92

### Text on the board
tPlace: 0 | 15 | 7 | 8 | 9 | 11 | 13 | reset | LDO | JTAG | Vin | + | 2 | 2 | divider | 1 | 3 | 4 | 6 | GND
bPlace: nRF51822 / Core / Protoboard | Version 1
tDocu: nRF51822 / Core